# Altium schematic sheet 1_P1.schdoc
size 429 x 307 mm; Symbol: Drawing-Symbol_A4; Device: Drawing-Symbol_A4; Company: 嘉立创EDA; Version: V1.0; Page Size: A4; @Project Name: PCB1; @Page Count: 1; @Update Date: 2025-07-18; @Create Date: 2025-07-09; @Schematic Name: Schematic1; @Page No: 1; @Page Name: P1; @Create Time: 14:20:13; @Update Time: 14:32:46; Width: 1655; Height: 1170; Region Start: 1; X Region Count: 6; Y Region Count: 4; Blade Width: 10; Title Block Position: 3; @Board Name: 主控板
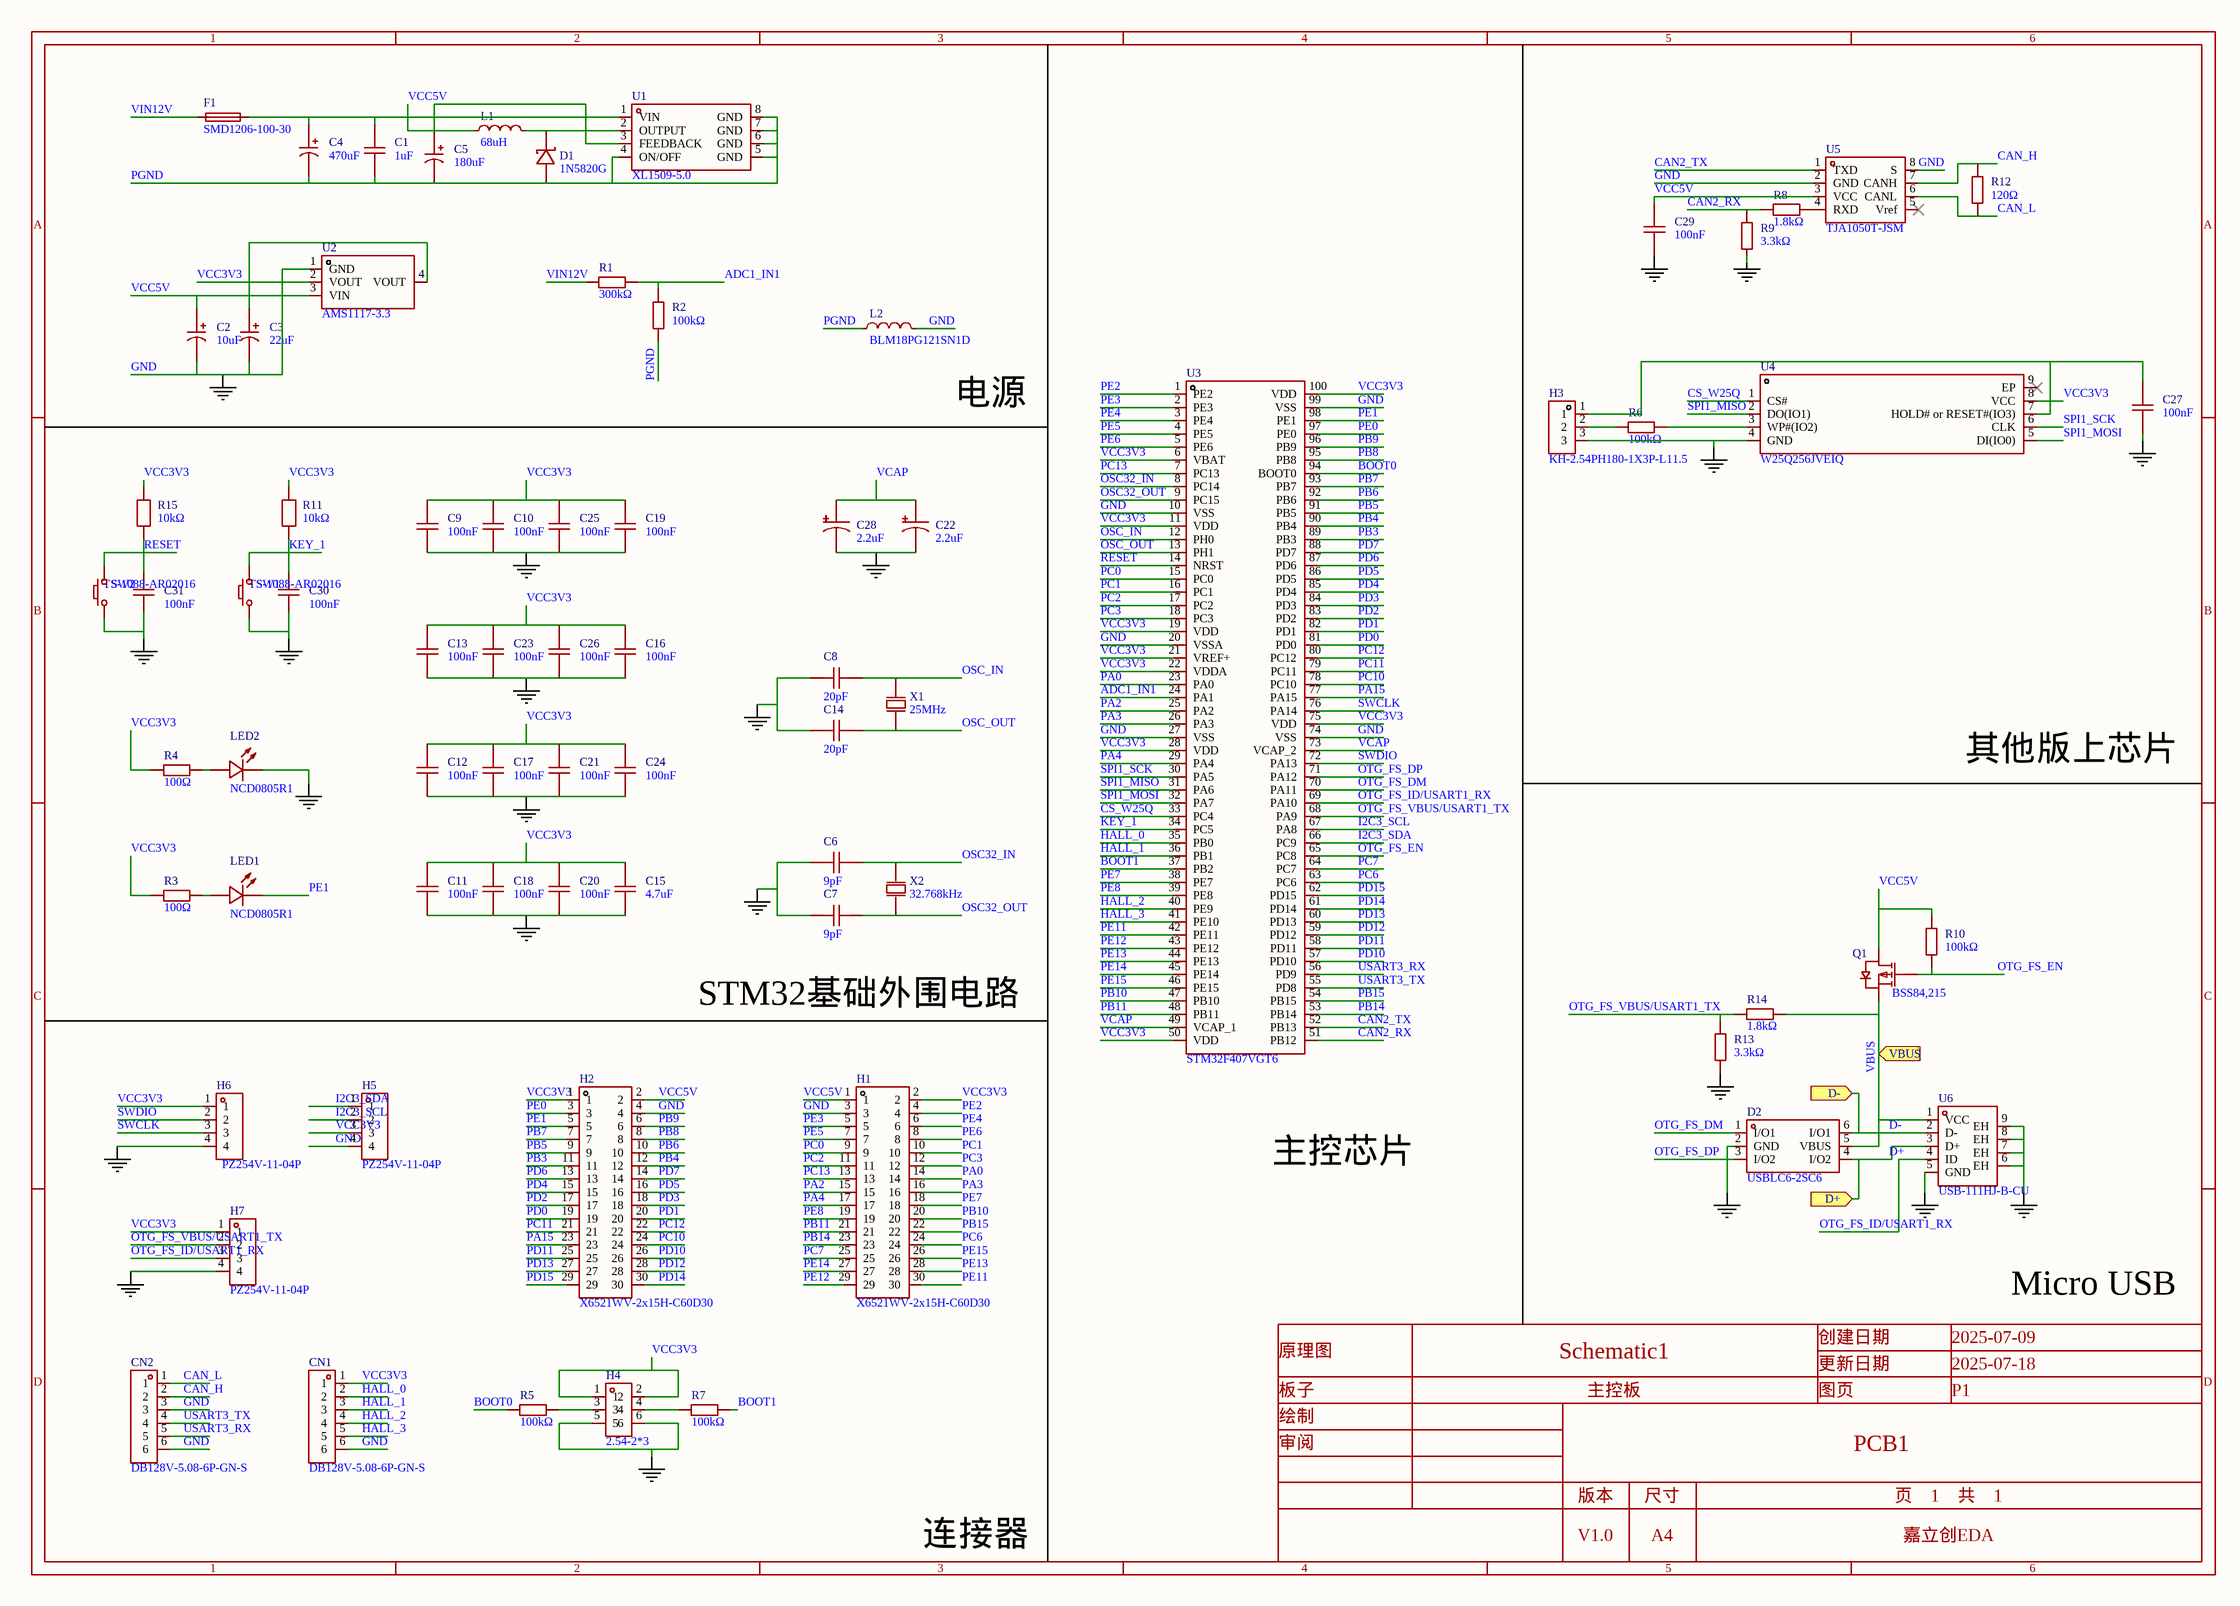
[diagram p0: 1_P1.schdoc]

## Parts
C1  1uF  [C0603]
C2  10uF  [CAP-SMD_BD4.0-L4.3-W4.3-LS5.0-FD]
C3  22uF  [CAP-SMD_L3.2-W1.6]
C4  470uF  [CAP-SMD_BD10.0-L10.3-W10.3-LS11.0-FD]
C5  180uF  [CAP-SMD_BD6.3-L6.6-W6.6-LS7.3-FD]
C6  9pF  [C0402]
C7  9pF  [C0402]
C8  20pF  [C0402]
C9  100nF  [C0603]
C10  100nF  [C0603]
C11  100nF  [C0603]
C12  100nF  [C0603]
C13  100nF  [C0603]
C14  20pF  [C0402]
C15  4.7uF  [C0805]
C16  100nF  [C0603]
C17  100nF  [C0603]
C18  100nF  [C0603]
C19  100nF  [C0603]
C20  100nF  [C0603]
C21  100nF  [C0603]
C22  2.2uF  [CAP-SMD_L3.5-W2.8-R-RD]
C23  100nF  [C0603]
C24  100nF  [C0603]
C25  100nF  [C0603]
C26  100nF  [C0603]
C27  100nF  [C0603]
C28  2.2uF  [CAP-SMD_L3.5-W2.8-R-RD]
C29  100nF  [C0603]
C30  100nF  [C0603]
C31  100nF  [C0603]
CN1  DB128V-5.08-6P-GN-S  [CONN-TH_6P-P5.08_DIBO_DB128V-5.08]
CN2  DB128V-5.08-6P-GN-S  [CONN-TH_6P-P5.08_DIBO_DB128V-5.08]
D1  1N5820G  [DO-201AD_BD5.3-L8.4-P12.50-D1.4-RD]
D2  USBLC6-2SC6  [SOT-23-6_L2.9-W1.6-P0.95-LS2.8-BL]
F1  SMD1206-100-30  [F1206]
H1  X6521WV-2x15H-C60D30  [HDR-TH_30P-P2.54-V-M-R2-C15-S2.54-BL]
H2  X6521WV-2x15H-C60D30  [HDR-TH_30P-P2.54-V-M-R2-C15-S2.54-BL]
H3  KH-2.54PH180-1X3P-L11.5  [HDR-TH_3P-P2.54-V-M]
H4  2.54-2*3  [HDR-TH_6P-P2.54-V-R2-C3-S2.54_A2541WV-2X3P]
H5  PZ254V-11-04P  [HDR-TH_4P-P2.54-V-M]
H6  PZ254V-11-04P  [HDR-TH_4P-P2.54-V-M]
H7  PZ254V-11-04P  [HDR-TH_4P-P2.54-V-M]
L1  68uH  [IND-SMD_L12.5-W12.5]
L2  BLM18PG121SN1D  [L0603]
LED1  NCD0805R1  [LED0805-R-RD]
LED2  NCD0805R1  [LED0805-R-RD]
Q1  BSS84,215  [SOT-23-3_L2.9-W1.3-P1.90-LS2.4-BR]
R1  300kΩ  [R0603]
R2  100kΩ  [R0603]
R3  100Ω  [R0603]
R4  100Ω  [R0603]
R5  100kΩ  [R0603]
R6  100kΩ  [R0603]
R7  100kΩ  [R0603]
R8  1.8kΩ  [R0603]
R9  3.3kΩ  [R0805]
R10  100kΩ  [R0603]
R11  10kΩ  [R0603]
R12  120Ω  [R0603]
R13  3.3kΩ  [R0805]
R14  1.8kΩ  [R0603]
R15  10kΩ  [R0603]
SW1  TS-1088-AR02016  [SW-SMD_L3.9-W3.0-P4.45]
SW2  TS-1088-AR02016  [SW-SMD_L3.9-W3.0-P4.45]
U1  XL1509-5.0  [SOIC-8_L4.9-W3.9-P1.27-LS6.0-TR]
U2  AMS1117-3.3  [SOT-223-3_L6.5-W3.4-P2.30-LS7.0-BR]
U3  STM32F407VGT6  [LQFP-100_L14.0-W14.0-P0.50-LS16.0-BL]
U4  W25Q256JVEIQ  [WSON-8_L6.0-W8.0-P1.27-BL-EP]
U5  TJA1050T-JSM  [SOIC-8_L4.9-W3.9-P1.27-LS6.0-BL]
U6  USB-111HJ-B-CU  [MICRO-USB-SMD_HOOYA_USB-111HJ-B-CU]
X1  25MHz  [HC-49S_L11.4-W4.8]
X2  32.768kHz  [CRYSTAL-SMD_L3.2-W1.5-1]

## Ports
D+ (in), D- (in), VBUS (in)

## Nets
GND: C2.2 C3.2 C6.1 C7.1 C8.1 C9.1 C10.1 C11.1 C12.1 C13.1 C14.1 C15.1 C16.1 C17.1 C18.1 C19.1 C20.1 C21.1 C22.2 C23.1 C24.1 C25.1 C26.1 C27.1 C28.2 C29.1 C30.1 C31.1 CN1.6 CN2.3 CN2.6 D2.2(GND) H1.3 H2.4 H3.3 H4.5 H4.6 H5.4 H6.4 H7.4 L2.2 LED2.2(-) R9.1 R13.1 SW1.A SW2.A U2.1(GND) U3.10(VSS) U3.20(VSSA) U3.27(VSS) U3.74(VSS) U3.99(VSS) U4.4(GND) U5.2(GND) U5.8(S) U6.5(GND) U6.6(EH) U6.7(EH) U6.8(EH) U6.9(EH)
ADC1_IN1: R1.2 R2.2 U3.24(PA1)
BOOT0: R5.1 U3.94(BOOT0)
BOOT1: R7.2 U3.37(PB2)
CAN2_RX: R8.1 R9.2 U3.51(PB12)
CAN2_TX: U3.52(PB13) U5.1(TXD)
CAN_H: CN2.2 R12.2 U5.7(CANH)
CAN_L: CN2.1 R12.1 U5.6(CANL)
CS_W25Q: U3.33(PC4) U4.1(CS#)
D+: D2.4(I/O2) U6.3(D+) ; port D+
D-: D2.6(I/O1) U6.2(D-) ; port D-
HALL_0: CN1.2 U3.35(PB0)
HALL_1: CN1.3 U3.36(PB1)
HALL_2: CN1.4 U3.40(PE9)
HALL_3: CN1.5 U3.41(PE10)
I2C3_SCL: H5.2 U3.67(PA8)
I2C3_SDA: H5.1 U3.66(PC9)
KEY_1: C30.2 R11.1 SW1.B U3.34(PC5)
OSC32_IN: C6.2 U3.8(PC14) X2.1(OSC1)
OSC32_OUT: C7.2 U3.9(PC15) X2.2(OSC2)
OSC_IN: C8.2 U3.12(PH0) X1.2(OSC2)
OSC_OUT: C14.2 U3.13(PH1) X1.1(OSC1)
OTG_FS_DM: D2.1(I/O1) U3.70(PA11)
OTG_FS_DP: D2.3(I/O2) U3.71(PA12)
OTG_FS_EN: Q1.1(G) R10.1 U3.65(PC8)
OTG_FS_ID/USART1_RX: H7.3 U3.69(PA10) U6.4(ID)
OTG_FS_VBUS/USART1_TX: H7.2 R13.2 R14.1 U3.68(PA9)
PA0: H1.14 U3.23(PA0)
PA2: H1.15 U3.25(PA2)
PA3: H1.16 U3.26(PA3)
PA4: H1.17 U3.29(PA4)
PA15: H2.23 U3.77(PA15)
PB3: H2.11 U3.89(PB3)
PB4: H2.12 U3.90(PB4)
PB5: H2.9 U3.91(PB5)
PB6: H2.10 U3.92(PB6)
PB7: H2.7 U3.93(PB7)
PB8: H2.8 U3.95(PB8)
PB9: H2.6 U3.96(PB9)
PB10: H1.20 U3.47(PB10)
PB11: H1.21 U3.48(PB11)
PB14: H1.23 U3.53(PB14)
PB15: H1.22 U3.54(PB15)
PC0: H1.9 U3.15(PC0)
PC1: H1.10 U3.16(PC1)
PC2: H1.11 U3.17(PC2)
PC3: H1.12 U3.18(PC3)
PC6: H1.24 U3.63(PC6)
PC7: H1.25 U3.64(PC7)
PC10: H2.24 U3.78(PC10)
PC11: H2.21 U3.79(PC11)
PC12: H2.22 U3.80(PC12)
PC13: H1.13 U3.7(PC13)
PD0: H2.19 U3.81(PD0)
PD1: H2.20 U3.82(PD1)
PD2: H2.17 U3.83(PD2)
PD3: H2.18 U3.84(PD3)
PD4: H2.15 U3.85(PD4)
PD5: H2.16 U3.86(PD5)
PD6: H2.13 U3.87(PD6)
PD7: H2.14 U3.88(PD7)
PD10: H2.26 U3.57(PD10)
PD11: H2.25 U3.58(PD11)
PD12: H2.28 U3.59(PD12)
PD13: H2.27 U3.60(PD13)
PD14: H2.30 U3.61(PD14)
PD15: H2.29 U3.62(PD15)
PE0: H2.3 U3.97(PE0)
PE1: H2.5 LED1.2(-) U3.98(PE1)
PE2: H1.4 U3.1(PE2)
PE3: H1.5 U3.2(PE3)
PE4: H1.6 U3.3(PE4)
PE5: H1.7 U3.4(PE5)
PE6: H1.8 U3.5(PE6)
PE7: H1.18 U3.38(PE7)
PE8: H1.19 U3.39(PE8)
PE11: H1.30 U3.42(PE11)
PE12: H1.29 U3.43(PE12)
PE13: H1.28 U3.44(PE13)
PE14: H1.27 U3.45(PE14)
PE15: H1.26 U3.46(PE15)
PGND: C1.1 C4.2 C5.2 D1.2(A) L2.1 R2.1 U1.4(ON/OFF) U1.5(GND) U1.6(GND) U1.7(GND) U1.8(GND)
RESET: C31.2 R15.1 SW2.B U3.14(NRST)
SPI1_MISO: U3.31(PA6) U4.2(DO(IO1))
SPI1_MOSI: U3.32(PA7) U4.5(DI(IO0))
SPI1_SCK: U3.30(PA5) U4.6(CLK)
SWCLK: H6.3 U3.76(PA14)
SWDIO: H6.2 U3.72(PA13)
USART3_RX: CN2.5 U3.56(PD9)
USART3_TX: CN2.4 U3.55(PD8)
VBUS: D2.5(VBUS) Q1.2(S) R14.2 U6.1(VCC) ; port VBUS
VCAP: C22.1 C28.1 U3.49(VCAP_1) U3.73(VCAP_2)
VCC3V3: C3.1 C9.2 C10.2 C11.2 C12.2 C13.2 C15.2 C16.2 C17.2 C18.2 C19.2 C20.2 C21.2 C23.2 C24.2 C25.2 C26.2 C27.2 CN1.1 H1.2 H2.1 H3.1 H4.1 H4.2 H5.3 H6.1 H7.1 R3.1 R4.1 R11.2 R15.2 U2.2(VOUT) U2.4(VOUT) U3.6(VBAT) U3.11(VDD) U3.19(VDD) U3.21(VREF+) U3.22(VDDA) U3.28(VDD) U3.50(VDD) U3.75(VDD) U3.100(VDD) U4.7(HOLD#_or_RESET#(IO3)) U4.8(VCC)
VCC5V: C2.1 C5.1 C29.2 H1.1 H2.2 L1.1 Q1.3(D) R10.2 U1.3(FEEDBACK) U2.3(VIN) U5.3(VCC)
VIN12V: F1.1 R1.1
NetC1_2: C1.2 C4.1 F1.2 U1.1(VIN)
NetD1_1: D1.1(C) L1.2 U1.2(OUTPUT)
NetH3_2: H3.2 R6.1
NetH4_3: H4.3 R5.2
NetH4_4: H4.4 R7.1
NetLED1_1: LED1.1(+) R3.2
NetLED2_1: LED2.1(+) R4.2
NetR6_2: R6.2 U4.3(WP#(IO2))
NetR8_2: R8.2 U5.4(RXD)

Not connected (* = marked no-connect by the designer): U4 9(EP)*; U5 5(Vref)*

## Notes on the sheet
- 电源
- 其他版上芯片
- STM32基础外围电路
- 主控芯片
- Micro USB
- 连接器
- 1
- 2
- 3
- 4
- 5
- 6
- A
- B
- C
- 原理图
- Schematic1
- 创建日期
- 更新日期
- 2025-07-09
- 2025-07-18
- D
- 板子
- 绘制
- 主控板
- 图页
- P1
- 审阅
- 版本
- 尺寸
- PCB1
- 页    1    共    1
- V1.0
- A4
- 嘉立创EDA

## Library data of the parts
C1 = CL10A105KB8NNNC: Manufacturer: SAMSUNG(三星); Add into BOM: yes; Tolerance: ±10%; Voltage Rated: 50V; Temperature Coefficient: X5R; Symbol: CL10A105KB8NNNC; Device: CL10A105KB8NNNC; LCSC Part Name: 1uF ±10% 50V; Supplier Part: C15849; Manufacturer Part: CL10A105KB8NNNC; Supplier Footprint: 0603; JLCPCB Part Class: 基础库; Datasheet: https://atta.szlcsc.com/upload/public/pdf/source/20160218/1457707763339.pdf; Supplier: LCSC; Convert to PCB: yes; Value: 1uF
C2 = VT10UF16V167RV0128: Manufacturer: KNSCHA(科尼盛); Add into BOM: yes; Tolerance: ±20%; Rated Voltage: 16V; Ripple Current: 18mA@120kHz; φD: 4mm; L: 5.4mm; Lifetime @ Temp: 2000hrs@105℃; Symbol: VT10UF16V167RV0128; Device: VT10UF16V167RV0128; LCSC Part Name: 10uF ±20% 16V; Supplier Part: C5246581; Manufacturer Part: VT10UF16V167RV0128; Supplier Footprint: SMD,D4xL5.4mm; JLCPCB Part Class: 扩展库; Datasheet: https://atta.szlcsc.com/upload/public/pdf/source/20221103/9F9BF07BB249386F3919A1DEC4ACBDCD.pdf; Supplier: LCSC; Convert to PCB: yes; Value: 10uF; Equivalent Series Resistance(ESR): -; Operating Temperature: -55℃~+105℃
C3 = CA45-A-16V-22uF-K: Manufacturer: CEC(振华新云); Add into BOM: yes; Tolerance: ±10%; Rated Voltage: 16V; Equivalent Series Resistance(ESR): 6Ω@100kHz; Symbol: CA45-A-16V-22UF-K; Device: CA45-A-16V-22uF-K; LCSC Part Name: 22uF ±10% 16V; Supplier Part: C782264; Manufacturer Part: CA45-A-16V-22uF-K; Supplier Footprint: CASE-A-3216; JLCPCB Part Class: 扩展库; Datasheet: https://atta.szlcsc.com/upload/public/pdf/source/20200909/C782264_D6D9C4EF3B25E81633C26A9294FBB820.pdf; Supplier: LCSC; Convert to PCB: yes; Value: 22uF; Operating Temperature: -55℃~+125℃
C4 = RVT470UF35V67RV0056: Manufacturer: KNSCHA(科尼盛); Add into BOM: yes; Tolerance: ±20%; Voltage Rating: 35V; Ripple Current: 286mA@120Hz; Lifetime: 2000hrs@105℃; Symbol: RVT470UF35V67RV0056; Device: RVT470UF35V67RV0056; LCSC Part Name: 470uF ±20% 35V; Supplier Part: C2836436; Manufacturer Part: RVT470UF35V67RV0056; Supplier Footprint: SMD,D10xL10.2mm; JLCPCB Part Class: 扩展库; Datasheet: https://atta.szlcsc.com/upload/public/pdf/source/20210528/C2836436_C8D3EEA5E3C1CA7F9FA48FC22CF12531.pdf; Supplier: LCSC; Convert to PCB: yes; Value: 470uF; Equivalent Series Resistance(ESR): -; Diameter: 10mm; Height - Seated (Max): 10.2mm; Operating Temperature: -55℃~+105℃
C5 = KNM2180UF16V118EC0094: Manufacturer: KNSCHA(科尼盛); Add into BOM: yes; Tolerance: ±20%; Rated Voltage: 16V; Ripple Current: 3.3A@100kHz; Equivalent Series Resistance(ESR): 22mΩ@100kHz; φD: 6.3mm; L: 6.5mm; Lifetime @ Temp: 2000hrs@105℃; Symbol: KNM2180UF16V118EC0094; Device: KNM2180UF16V118EC0094; LCSC Part Name: 180uF ±20% 16V; Supplier Part: C2943990; Manufacturer Part: KNM2180UF16V118EC0094; Supplier Footprint: SMD,D6.3xL6.5mm; JLCPCB Part Class: 扩展库; Datasheet: https://atta.szlcsc.com/upload/public/pdf/source/20220426/2498E51E5C1E4E393AA07C1BCCDA9F22.pdf; Supplier: LCSC; Convert to PCB: yes; Value: 180uF; Lead Spacing: 2.5mm; Operating Temperature: -55℃~+105℃
C6 C7 = GJM1555C1H9R0BB01D: Manufacturer: muRata(村田); Add into BOM: yes; Voltage Rating: 50V; Temperature Coefficient: C0G; Symbol: GJM1555C1H9R0BB01D; Device: GJM1555C1H9R0BB01D; LCSC Part Name: ±0.1pF 9pF 50V; Supplier Part: C88899; Manufacturer Part: GJM1555C1H9R0BB01D; Supplier Footprint: 0402; JLCPCB Part Class: 扩展库; Datasheet: https://atta.szlcsc.com/upload/public/pdf/source/20241220/D0AFAF126C1929700C0BCD7972400352.pdf; Supplier: LCSC; Convert to PCB: yes; Value: 9pF
C8 C14 = GRM1555C1H200JA01D: Manufacturer: muRata(村田); Add into BOM: yes; Tolerance: ±5%; Voltage Rated: 50V; Temperature Coefficient: C0G; Symbol: GRM1555C1H200JA01D; Device: GRM1555C1H200JA01D; LCSC Part Name: 20pF ±5% 50V; Supplier Part: C76959; Manufacturer Part: GRM1555C1H200JA01D; Supplier Footprint: 0402; JLCPCB Part Class: 扩展库; Datasheet: https://atta.szlcsc.com/upload/public/pdf/source/20180307/C76959_15204091273971407747.pdf; Supplier: LCSC; Convert to PCB: yes; Value: 20pF
C9-C13 C16-C21 C23-C27 C29 = CGA0603X7R104K500JT: Manufacturer: HRE(芯声); Add into BOM: yes; Tolerance: ±10%; Voltage Rating: 50V; Temperature Coefficient: X7R; Symbol: CGA0603X7R104K500JT; Device: CGA0603X7R104K500JT; LCSC Part Name: 100nF ±10% 50V; Supplier Part: C6119867; Manufacturer Part: CGA0603X7R104K500JT; Supplier Footprint: 0603; JLCPCB Part Class: 扩展库; Datasheet: https://atta.szlcsc.com/upload/public/pdf/source/20250103/C44077DA9E7B3EFAE02F22B6D3D1CBC9.pdf; Supplier: LCSC; Convert to PCB: yes; Value: 100nF
C15 = CGA0805X7R475K350MT: Manufacturer: HRE(芯声); Add into BOM: yes; Tolerance: ±10%; Voltage Rated: 35V; Temperature Coefficient: X7R; Symbol: CGA0805X7R475K350MT; Device: CGA0805X7R475K350MT; LCSC Part Name: 4.7uF ±10% 35V; Supplier Part: C6119943; Manufacturer Part: CGA0805X7R475K350MT; Supplier Footprint: 0805; JLCPCB Part Class: 扩展库; Supplier: LCSC; Convert to PCB: yes; Value: 4.7uF
C22 C28 = CA45A-B-50V-2.2UF-K: Manufacturer: CEC(振华新云); Add into BOM: yes; Tolerance: ±10%; Voltage Rating: 50V; Current - Leakage: 1.1uA@25°C,5min; Equivalent Series Resistance(ESR): 4Ω@100kHz; Symbol: CA45A-B-50V-2.2UF-K; Device: CA45A-B-50V-2.2UF-K; LCSC Part Name: 2.2uF ±10% 50V; Supplier Part: C3202859; Manufacturer Part: CA45A-B-50V-2.2UF-K; Supplier Footprint: CASE-B-3528-19(mm); JLCPCB Part Class: 扩展库; Datasheet: https://atta.szlcsc.com/upload/public/pdf/source/20220331/9EC1019083AD796DA5C9626021BE8B57.pdf; Supplier: LCSC; Convert to PCB: yes; Value: 2.2uF; Ripple Current: -; Operating Temperature: -55℃~+125℃
C30 C31 = CT41G-0603-2X1-50V-0.1μF-K(N): Manufacturer: TORCH(火炬); Add into BOM: yes; Tolerance: ±10%; Voltage Rating: 50V; Symbol: CT41G-0603-2X1-50V-0.1μF-K(N); Device: CT41G-0603-2X1-50V-0.1μF-K(N); LCSC Part Name: 100nF ±10% 50V; Supplier Part: C125205; Manufacturer Part: CT41G-0603-2X1-50V-0.1μF-K(N); Supplier Footprint: 0603; JLCPCB Part Class: 扩展库; Datasheet: https://atta.szlcsc.com/upload/public/pdf/source/20171225/C150708_15141883600121203188.pdf; Supplier: LCSC; Convert to PCB: yes; Value: 100nF; Temperature Coefficient: -
CN1 CN2 = DB128V-5.08-6P-GN-S: Manufacturer: DORABO(地博电气); Add into BOM: yes; Number of Positions or Pins: 1x6P; Pitch: 5.08mm; Number of PINs Per Row: 6; Screw Specification: M2.5; Current Rating: 16A; Voltage Rating (Max): 300V; Wire Gauge - AWG: 12~22; Wire Gauge - mm2: 2.5; Symbol: DB128V-5.08-6P-GN-S; Device: DB128V-5.08-6P-GN-S; LCSC Part Name: 1x6P 5.08mm 直插 排数:1 每排P数:6; Supplier Part: C2915642; Manufacturer Part: DB128V-5.08-6P-GN-S; Supplier Footprint: 插件,P=5.08mm; Datasheet: https://atta.szlcsc.com/upload/public/pdf/source/20230106/CC449C10514519CDCE20F1C37DBF2DAC.pdf; Supplier: LCSC; Convert to PCB: yes; Color: 绿色; Mounting Type: 直插; Number of Pins: 6P; Number of Rows: 1; Operating Temperature: -40℃~+105℃
D1 = 1N5820G: Manufacturer: onsemi(安森美); Add into BOM: yes; Forward Voltage (Vf@If): 475mV@3A; Reverse Voltage (Vr): 20V; Average Rectified Current (Io): 3A; Reverse Leakage Current (Ir): 2mA@20V; Symbol: 1N5820G; Device: 1N5820G; LCSC Part Name: 电压:20V 电流:3A; Supplier Part: C95400; Manufacturer Part: 1N5820G; Supplier Footprint: DO-201AD; JLCPCB Part Class: 扩展库; Datasheet: https://atta.szlcsc.com/upload/public/pdf/source/20221020/278CB0A15AF2705A206F2F139E5C3CB6.pdf; Supplier: LCSC; Convert to PCB: yes
D2 = USBLC6-2SC6: Manufacturer: UMW(友台半导体); Symbol: USBLC6-2SC6_C2687116; Add into BOM: yes; Maximum Clamping Voltage: 15V; Breakdown Voltage: 6V; Number of Lines: 双路; Type: ESD; Device: USBLC6-2SC6; LCSC Part Name: USBLC6-2SC6; Supplier Part: C2687116; Manufacturer Part: USBLC6-2SC6; Supplier Footprint: SOT-23-6; Datasheet: https://atta.szlcsc.com/upload/public/pdf/source/20231109/512642D850D9873E7C519F71E85B9A10.pdf; Supplier: LCSC; Convert to PCB: yes
F1 = SMD1206-100-30: Manufacturer: 宏嘉诚; Add into BOM: yes; Voltage - Max: 30V; Current - Max: 40A; Hold Current: 1A; Trip Current: 1.8A; Power Dissipation: 1W; Resistance - Initial (Ri) (Min): 50mΩ; Resistance - Post Trip (R1) (Max): 300mΩ; Time to Trip(Max): 300ms; Symbol: SMD1206-100-30; Device: SMD1206-100-30; LCSC Part Name: SMD1206-100-30; Supplier Part: C46641026; Manufacturer Part: SMD1206-100-30; Supplier Footprint: 1206; JLCPCB Part Class: 扩展库; Datasheet: https://atta.szlcsc.com/upload/public/pdf/source/20250414/5AC46D2F961B725C9DB708C91B04DBEC.pdf; Supplier: LCSC; Convert to PCB: yes
H1 H2 = X6521WV-2x15H-C60D30: Manufacturer: XKB Connection(中国星坤); Symbol: X6521WV-2×15H-C30D60; Add into BOM: yes; Pin Structure: 2x15P; Pitch: 2.54mm; Circluar Pins/Square Pins: 方针; Current Rating: 3A; Voltage Rating (Max): 250V; Device: X6521WV-2x15H-C60D30; LCSC Part Name: 2x15P 间距:2.54mm 方针; Supplier Part: C725887; Manufacturer Part: X6521WV-2x15H-C60D30; Supplier Footprint: 插件,P=2.54mm; Datasheet: https://atta.szlcsc.com/upload/public/pdf/source/20230814/F1C4971E164A170E66FC7330ABFF6881.pdf; Supplier: LCSC; Convert to PCB: yes; Row Spacing: 2.54mm; Number of Rows: 双排; Number of Pins: 30P; Length of Mating Pin: -; Insulation Height: 2.5mm; Length of End Connection Pin: -; Contact Material: 黄铜; Contact Plating: 金; Operating Temperature: -40℃~+105℃; Color: 黑色
H3 = KH-2.54PH180-1X3P-L11.5: Manufacturer: kinghelm(金航标); Add into BOM: yes; Pin Structure: 1x3P; Pitch: 2.54mm; Circluar Pins/Square Pins: 方针; Current Rating: 3A; Symbol: KH-2.54PH180-1X3P-L11.5; Device: KH-2.54PH180-1X3P-L11.5; LCSC Part Name: 1x3P 间距:2.54mm 方针 直插; Supplier Part: C2932698; Manufacturer Part: KH-2.54PH180-1X3P-L11.5; Supplier Footprint: 插件,P=2.54mm; JLCPCB Part Class: 扩展库; Datasheet: https://atta.szlcsc.com/upload/public/pdf/source/20211220/D2AB060C07EA7DD91A5B4AA994AB98CA.pdf; Supplier: LCSC; Convert to PCB: yes; Row Spacing: -; Mounting Type: 直插; Number of Rows: 单排; Number of Pins: 3P; Voltage Rating (Max): -; Length of Mating Pin: 6mm; Insulation Height: 2.5mm; Length of End Connection Pin: 3mm; Operating Temperature: -40℃~+105℃; Color: 黑色
H4 = 2.54-2*3: Manufacturer: ZHOURI(洲日); Add into BOM: yes; Pin Structure: 2x3P; Pitch: 2.54mm; Symbol: 2.54-2*3; Device: 2.54-2*3; LCSC Part Name: 2.54-2*3; Supplier Part: C5116479; Manufacturer Part: 2.54-2*3; Supplier Footprint: 插件,P=2.54mm; Datasheet: https://atta.szlcsc.com/upload/public/pdf/source/20220729/7A96040568D3A9F25ED0F1D4F891C529.pdf; Supplier: LCSC; Convert to PCB: yes; Number of Rows: 双排; Number of Pins: 6P
H5-H7 = PZ254V-11-04P: Manufacturer: XFCN(兴飞); Symbol: PZ254V-11-04P_C2691448; Add into BOM: yes; Pin Structure: 1x4P; Pitch: 2.54mm; Circluar Pins/Square Pins: 方针; Current Rating (Max): 3A; Voltage Rating (Max): 250V; Device: PZ254V-11-04P; LCSC Part Name: 间距:2.54mm 1x4P 直插 方针; Supplier Part: C2691448; Manufacturer Part: PZ254V-11-04P; Supplier Footprint: 插件,P=2.54mm; JLCPCB Part Class: 扩展库; Datasheet: https://atta.szlcsc.com/upload/public/pdf/source/20200309/C492403_F9F19131791D08044AD4F84F8E751A34.pdf; Supplier: LCSC; Convert to PCB: yes; Row Spacing: -; Mounting Type: 直插; Number of Rows: 单排; Number of Pins: 4P; Length of Mating Pin: 6mm; Insulation Height: 2.5mm; Length of End Connection Pin: 3mm; Contact Material: -; Operating Temperature Range: -40℃~+105℃; Color: 黑色
L1 = CYH125-68UH: Manufacturer: SHOU HAN(首韩); Add into BOM: yes; Tolerance: ±20%; Rated Current: 3A; DC Resistance (DCR): 64.8mΩ; Symbol: CYH125-68UH; Device: CYH125-68UH; LCSC Part Name: 68uH ±20%; Supplier Part: C7431083; Manufacturer Part: CYH125-68UH; Supplier Footprint: SMD,12.5x12.5mm; JLCPCB Part Class: 扩展库; Datasheet: https://atta.szlcsc.com/upload/public/pdf/source/20230621/00B923FD072A2FA4420B8D9BC7718C72.pdf; Supplier: LCSC; Convert to PCB: yes; Value: 68uH
L2 = BLM18PG121SN1D: Manufacturer: muRata(村田); Symbol: BLM18PG121SN1D_C14709; Add into BOM: yes; Impedance @ Frequency: 120Ω@100MHz; Tolerance: ±25%; DC Resistance: 50mΩ; Current Rating: 2A; Circuits: 1; Device: BLM18PG121SN1D; LCSC Part Name: 单路 0603磁珠 阻抗120Ω@100MHz; Supplier Part: C14709; Manufacturer Part: BLM18PG121SN1D; Supplier Footprint: 0603; JLCPCB Part Class: 基础库; Datasheet: https://atta.szlcsc.com/upload/public/pdf/source/20130704/1457706621422.pdf; Supplier: LCSC; Convert to PCB: yes
LED1 LED2 = NCD0805R1: Manufacturer: 国星光电; Symbol: FC-2012HRK-620D; Add into BOM: yes; Emitted Color: 红色; Forward Voltage (VF): 1.6V~2.6V; Power Dissipation: 65mW; Forward Current: 20mA; Dominant Wavelength: 615nm~630nm; Diode Configuration: 独立二极管; Lens Color: 无色透明透镜; Luminous Intensity: 67mcd~195mcd; Viewing Angle: 130°; Device: NCD0805R1; LCSC Part Name: NCD0805R1; Supplier Part: C84256; Manufacturer Part: NCD0805R1; Supplier Footprint: 0805; JLCPCB Part Class: 基础库; Datasheet: https://atta.szlcsc.com/upload/public/pdf/source/20200820/C84256_F0A75A43B3EAD75808600A0514C76B99.pdf; Supplier: LCSC; Convert to PCB: yes; Lamp Holder Type: -; Peak Wavelength: -; Color Temperature: -; Mounting Sytle: -; Operating Temperature: -30℃~+85℃
Q1 = BSS84,215: Manufacturer: Nexperia(安世); Symbol: BSS84,215_C493579; Add into BOM: yes; Type: 1个P沟道; Drain Source Voltage (Vdss): 50V; Continuous Drain Current (Id): 130mA; Drain Source On Resistance (RDS(on)@Vgs,Id): 10Ω@130mA,10V; Power Dissipation (Pd): 250mW; Gate Threshold Voltage (Vgs(th)@Id): 2V@1mA; Input Capacitance (Ciss@Vds): 45pF@25V; Device: BSS84,215; LCSC Part Name: 1个P沟道 耐压:50V 电流:130mA; Supplier Part: C493579; Manufacturer Part: BSS84,215; Supplier Footprint: SOT-23-3; Datasheet: https://atta.szlcsc.com/upload/public/pdf/source/20200310/C493579_AC1E42EAECEF89DE401195CE068ACE7E.pdf; Supplier: LCSC; Convert to PCB: yes; Total Gate Charge (Qg@Vgs): -; Reverse Transfer Capacitance (Crss@Vds): -; Operating Temperature: -65℃~+150℃@(Tj)
R1 = RC0603FR-07300KL: Manufacturer: YAGEO(国巨); Add into BOM: yes; Tolerance: ±1%; Power(Watts): 100mW; Overload Voltage (Max): 75V; Temperature Coefficient: ±100ppm/℃; Symbol: RC0603FR-07300KL; Device: RC0603FR-07300KL; LCSC Part Name: 厚膜电阻 300kΩ ±1% 100mW; Supplier Part: C114667; Manufacturer Part: RC0603FR-07300KL; Supplier Footprint: 0603; Datasheet: https://atta.szlcsc.com/upload/public/pdf/source/20180821/C275644_0D56F95EFF785E7D9A1FEF436B37DA78.pdf; Supplier: LCSC; Convert to PCB: yes; Type: 厚膜电阻; Value: 300kΩ; Operating Temperature Range: -55℃~+155℃
R2 R5-R7 R10 = RC0603FR-07100KL: Manufacturer: YAGEO(国巨); Add into BOM: yes; Tolerance: ±1%; Power(Watts): 100mW; Overload Voltage (Max): 75V; Temperature Coefficient: ±100ppm/℃; Symbol: RC0603FR-07100KL; Device: RC0603FR-07100KL; LCSC Part Name: 厚膜电阻 100kΩ ±1% 100mW; Supplier Part: C14675; Manufacturer Part: RC0603FR-07100KL; Supplier Footprint: 0603; JLCPCB Part Class: 扩展库; Datasheet: https://atta.szlcsc.com/upload/public/pdf/source/20140324/1457707028752.pdf; Supplier: LCSC; Convert to PCB: yes; Type: 厚膜电阻; Value: 100kΩ; Operating Temperature Range: -55℃~+155℃
R3 R4 = 0603WAF1000T5E: Manufacturer: UNI-ROYAL(厚声); Add into BOM: yes; Tolerance: ±1%; Power(Watts): 100mW; Overload Voltage (Max): 75V; Temperature Coefficient: ±200ppm/℃; Symbol: 0603WAF1000T5E; Device: 0603WAF1000T5E; LCSC Part Name: 100Ω ±1% 100mW 厚膜电阻; Supplier Part: C22775; Manufacturer Part: 0603WAF1000T5E; Supplier Footprint: 0603; JLCPCB Part Class: 基础库; Datasheet: https://atta.szlcsc.com/upload/public/pdf/source/20200306/C422600_1E6D84923E4A46A82E41ADD87F860B5C.pdf; Supplier: LCSC; Convert to PCB: yes; Type: 厚膜电阻; Value: 100Ω; Operating Temperature Range: -55℃~+155℃
R8 R14 = RMC06031.8K1%N: Manufacturer: Tyohm(幸亚电阻); Add into BOM: yes; Tolerance: ±1%; Power(Watts): 100mW; Symbol: RMC06031.8K1%N; Device: RMC06031.8K1%N; LCSC Part Name: 1.8kΩ ±1% 100mW; Supplier Part: C269444; Manufacturer Part: RMC06031.8K1%N; Supplier Footprint: 0603; JLCPCB Part Class: 扩展库; Datasheet: https://atta.szlcsc.com/upload/public/pdf/source/20190115/C325956_D27151D492FFB3C9AB4A6F14FE01F30A.pdf; Supplier: LCSC; Convert to PCB: yes; Value: 1.8kΩ
R9 R13 = RC0805JR-073K3L: Manufacturer: YAGEO(国巨); Add into BOM: yes; Tolerance: ±5%; Power(Watts): 125mW; Voltage-Supply(Max): 150V; Temperature Coefficient: ±100ppm/℃; Symbol: RC0805JR-073K3L; Device: RC0805JR-073K3L; LCSC Part Name: 厚膜电阻 3.3kΩ ±5% 125mW; Supplier Part: C114222; Manufacturer Part: RC0805JR-073K3L; Supplier Footprint: 0805; JLCPCB Part Class: 扩展库; Datasheet: https://atta.szlcsc.com/upload/public/pdf/source/20170705/1499242701205.pdf; Supplier: LCSC; Convert to PCB: yes; Type: 厚膜电阻; Value: 3.3kΩ; Operating Temperature: -55℃~+155℃
R11 R15 = FRC0603J103 TS: Manufacturer: FOJAN(富捷); Add into BOM: yes; Tolerance: ±5%; Power(Watts): 100mW; Voltage-Supply(Max): 75V; Temperature Coefficient: ±100ppm/℃; Symbol: FRC0603J103TS; Device: FRC0603J103 TS; LCSC Part Name: 10kΩ ±5% 100mW 厚膜电阻; Supplier Part: C2930027; Manufacturer Part: FRC0603J103 TS; Supplier Footprint: 0603; JLCPCB Part Class: 扩展库; Datasheet: https://atta.szlcsc.com/upload/public/pdf/source/20211221/925EC7D7225764EE0046F22065062C87.pdf; Supplier: LCSC; Convert to PCB: yes; Type: 厚膜电阻; Value: 10kΩ; Operating Temperature: -55℃~+155℃
R12 = 0603WAF1200T5E: Manufacturer: UNI-ROYAL(厚声); Add into BOM: yes; Tolerance: ±1%; Power(Watts): 100mW; Overload Voltage (Max): 75V; Temperature Coefficient: ±100ppm/℃; Symbol: 0603WAF1200T5E; Device: 0603WAF1200T5E; LCSC Part Name: 120Ω ±1% 100mW 厚膜电阻; Supplier Part: C22787; Manufacturer Part: 0603WAF1200T5E; Supplier Footprint: 0603; Datasheet: https://atta.szlcsc.com/upload/public/pdf/source/20200306/C422600_1E6D84923E4A46A82E41ADD87F860B5C.pdf; Supplier: LCSC; Convert to PCB: yes; Type: 厚膜电阻; Value: 120Ω; Operating Temperature Range: -55℃~+155℃
SW1 = TS-1088-AR02016: Manufacturer: XUNPU(讯普); Symbol: Key_TH_3.5x6x4.3; Add into BOM: yes; Circuit: 单刀单掷; Actuator Style: 圆形按钮; Operating Force: 160gf; Switch Length: 4mm; Switch Width: 3mm; Switch Height: 2mm; Strike Gundam: 不带; Contact Current: 50mA; Voltage Rating (DC): 12V; Insulation Resistance: 100MΩ; Actuator/Cap Color: 黑色; Pin Style: SMD接片; Mechanical Life: 10万次; Channel ID: $1e24611; Device: TS-1088-AR02016; LCSC Part Name: 4*3*2mm 立贴 轻触开关; Supplier Part: C720477; Manufacturer Part: TS-1088-AR02016; Supplier Footprint: SMD; JLCPCB Part Class: Basic Part; Datasheet: https://atta.szlcsc.com/upload/public/pdf/source/20200810/C720475_60D09DD6C54279ADDB2DC25100F1CC11.pdf; Supplier: LCSC; Convert to PCB: yes; Mounting Style: 立贴; Operating Temperature: -30℃~+80℃; FootprintName: SW-SMD_L3.9-W3.0-P4.45; DeviceName: TS-1088-AR02016
SW2 = TS-1088-AR02016: Manufacturer: XUNPU(讯普); Symbol: Key_TH_3.5x6x4.3; Add into BOM: yes; Circuit: 单刀单掷; Actuator Style: 圆形按钮; Operating Force: 160gf; Switch Length: 4mm; Switch Width: 3mm; Switch Height: 2mm; Strike Gundam: 不带; Contact Current: 50mA; Voltage Rating (DC): 12V; Insulation Resistance: 100MΩ; Actuator/Cap Color: 黑色; Pin Style: SMD接片; Mechanical Life: 10万次; Channel ID: $1e1389; Device: TS-1088-AR02016; LCSC Part Name: 4*3*2mm 立贴 轻触开关; Supplier Part: C720477; Manufacturer Part: TS-1088-AR02016; Supplier Footprint: SMD; JLCPCB Part Class: Basic Part; Datasheet: https://atta.szlcsc.com/upload/public/pdf/source/20200810/C720475_60D09DD6C54279ADDB2DC25100F1CC11.pdf; Supplier: LCSC; Convert to PCB: yes; Mounting Style: 立贴; Operating Temperature: -30℃~+80℃; FootprintName: SW-SMD_L3.9-W3.0-P4.45; DeviceName: TS-1088-AR02016
U1 = XL1509-5.0: Manufacturer: UMW(友台半导体); Symbol: XL1509-5.0_C2902368; Add into BOM: yes; Function: 降压型; Output Type: 固定; Input Voltage: 4.5V~40V; Output Voltage: 5V; Output Current: 2A; Switching Frequency: 150kHz; Synchronous Rectification: 否; Number of Outputs: 1; Topology: 降压式; Quiescent Current (Iq): 150uA; Switch tube (built-in/external): 内置; Device: XL1509-5.0; LCSC Part Name: 150 KHz 固定频率 PWM 降压 DC/DC 转换器; Supplier Part: C2902368; Manufacturer Part: XL1509-5.0; Supplier Footprint: SOIC-8; JLCPCB Part Class: 扩展库; Datasheet: https://atta.szlcsc.com/upload/public/pdf/source/20241113/D9907419AB21EE12D855D7DFAFDDCB19.pdf; Supplier: LCSC; Convert to PCB: yes; Operating Temperature: -40℃~+125℃
U2 = AMS1117-3.3_C6186: Manufacturer: AMS; Add into BOM: yes; Output Type: 固定; Voltage - Supply: 16V; Output Voltage: 3.3V; Output Current: 1A; Power Supply Rejection Ratio (PSRR): 72dB@(120Hz); Voltage Dropout: 1.1V@(800mA); standby current: 5mA; Output Configuration: 正极; Number of Outputs: 1; Symbol: AMS1117-3.3; Device: AMS1117-3.3_C6186; LCSC Part Name: 输出3.3V 1A; Supplier Part: C6186; Manufacturer Part: AMS1117-3.3; Supplier Footprint: SOT-223; JLCPCB Part Class: 基础库; Datasheet: https://atta.szlcsc.com/upload/public/pdf/source/20180727/C6186_7A095716F0823C02F1997A905E26C086.pdf; Supplier: LCSC; Convert to PCB: yes; Noise: -; Features: 过流保护；过热保护; Operating Temperature: -40℃~+125℃
U3 = STM32F407VGT6: Manufacturer: ST(意法半导体); Add into BOM: yes; CPU Core: ARM-M4; CPU Maximum Speed: 168MHz; Program Storage Size: 1MB; Program Memory Type: FLASH; Number of I/O: 82; ADC (Bit): 12bit; Voltage - Supply: 1.8V~3.6V; Symbol: STM32F407VGT6; Device: STM32F407VGT6; LCSC Part Name: 带DSP和FPU的高性能基础系列ARM Cortex-M4 MCU，具有1 MB Flash、168 MHz CPU、ART加速器、以太网和FSMC; Supplier Part: C12345; Manufacturer Part: STM32F407VGT6; Supplier Footprint: LQFP-100(14x14); JLCPCB Part Class: 扩展库; Datasheet: https://atta.szlcsc.com/upload/public/pdf/source/20201130/C919362_39400D478C258148B3DF984CE4A4041A.pdf; Supplier: LCSC; Convert to PCB: yes; DAC (Bit): 12bit; Applications: -
U4 = W25Q256JVEIQ: Manufacturer: Winbond(华邦); Add into BOM: yes; Symbol: W25Q256JVEIQ; Device: W25Q256JVEIQ; LCSC Part Name: W25Q256JVEIQ; Supplier Part: C2682312; Manufacturer Part: W25Q256JVEIQ; Supplier Footprint: WSON-8-EP(6x8); JLCPCB Part Class: 扩展库; Datasheet: https://atta.szlcsc.com/upload/public/pdf/source/20190529/C97522_47AE152D0BB11FB4C8509E398C0AD2EA.pdf; Supplier: LCSC; Convert to PCB: yes
U5 = TJA1050T-JSM: Manufacturer: JSMSEMI(杰盛微); Add into BOM: yes; Data Rate: 1Mbps; Supply Voltage: 4.5V~5.5V; Symbol: TJA1050T-JSM; Device: TJA1050T-JSM; LCSC Part Name: TJA1050T; Supplier Part: C21714366; Manufacturer Part: TJA1050T-JSM; Supplier Footprint: SOP-8; JLCPCB Part Class: 扩展库; Datasheet: https://atta.szlcsc.com/upload/public/pdf/source/20240307/226A42A673340FFB74D7F8B5A383F6D1.pdf; Supplier: LCSC; Convert to PCB: yes; Operating Temperature: -40℃~+150℃
U6 = USB-111HJ-B-CU: Manufacturer: HOOYA(皓宇电子); Add into BOM: yes; Number of Contacts: 5P; Symbol: USB-111HJ-B-CU; Device: USB-111HJ-B-CU; LCSC Part Name: USB-111HJ-B-CU; Supplier Part: C19712370; Manufacturer Part: USB-111HJ-B-CU; Supplier Footprint: SMD; Datasheet: https://atta.szlcsc.com/upload/public/pdf/source/20231222/A6F13E0F491DBE2F7014157678E3AF70.pdf; Supplier: LCSC; Convert to PCB: yes
X1 = X49SM25MSD2SC: Manufacturer: YXC(扬兴晶振); Add into BOM: yes; Normal temperature Frequency Tolerance: ±20ppm; Load Capacitance: 20pF; Frequency Stability: ±30ppm; Symbol: X49SM25MSD2SC; Device: X49SM25MSD2SC; LCSC Part Name: HC-49SMD 25MHZ 2P 49SMD 20PF ±20PPM -20~70℃（±30PPM）; Supplier Part: C14872; Manufacturer Part: X49SM25MSD2SC; Supplier Footprint: HC-49S-SMD; Datasheet: https://atta.szlcsc.com/upload/public/pdf/source/20240329/3EBF42EBCAB50CA65B6FA9D7CFA1955A.pdf; Supplier: LCSC; Convert to PCB: yes; Type: 贴片晶振; Value: 25MHz; Operating Temperature: -20℃~+70℃
X2 = XKXGI-SUA-32.768K: Manufacturer: YXC(扬兴晶振); Add into BOM: yes; Normal temperature Frequency Tolerance: ±20ppm; Load Capacitance: 12.5pF; Frequency Stability: ±30ppm; Symbol: XKXGI-SUA-32.768K; Device: XKXGI-SUA-32.768K; LCSC Part Name: YST310S 32.768KHZ 2P 3215 12.5PF ±20PPM -40~85℃; Supplier Part: C5213671; Manufacturer Part: XKXGI-SUA-32.768K; Supplier Footprint: SMD3215-2P; JLCPCB Part Class: 扩展库; Datasheet: https://atta.szlcsc.com/upload/public/pdf/source/20240329/3A7650FD985DD0DE85694D3785AB4916.pdf; Supplier: LCSC; Convert to PCB: yes; Type: 贴片晶振; Value: 32.768kHz; Operating Temperature: -40℃~+85℃